# Altium schematic sheet Backplane_Powersupply.SchDoc
size A4
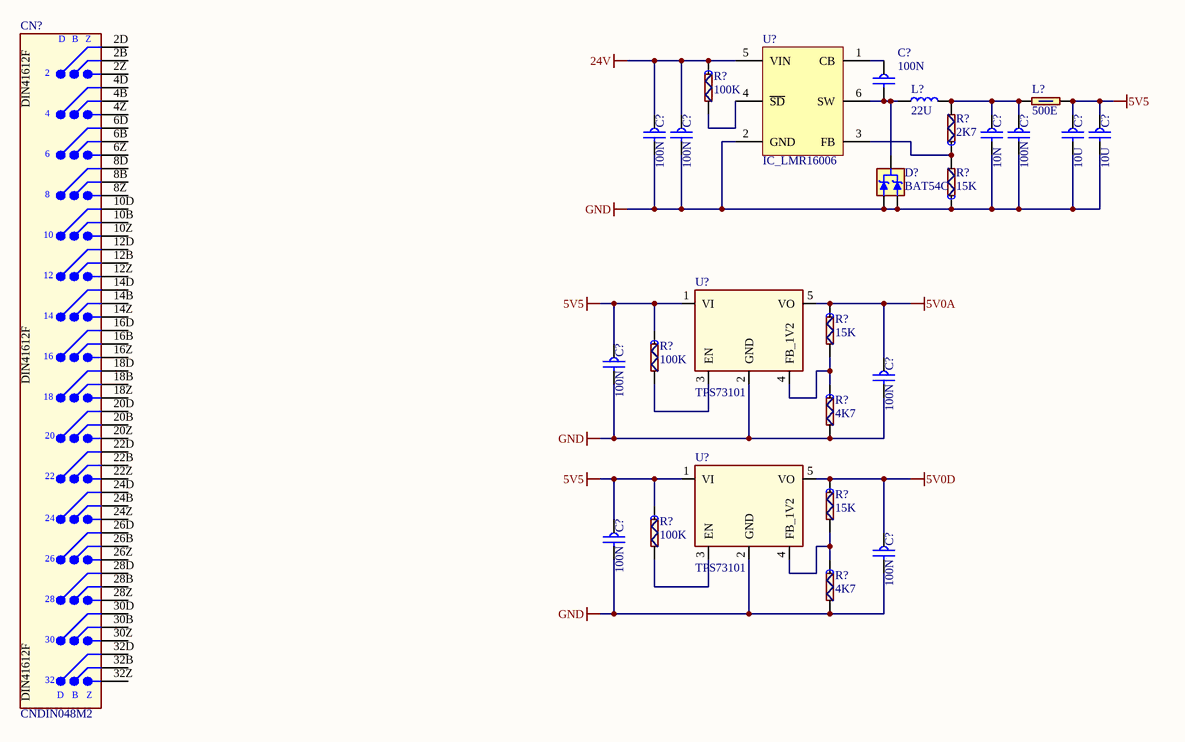
[diagram p0: Backplane_Powersupply.SchDoc]

## Parts
(Parts that share a designator on the sheet are numbered #1, #2 ... from top to bottom, then left to right.)
C?#1  100N  [CA_STD0603_H8]
C?#2  100N  [CA_STD0603_H8]
C?#3  100N  [CA_STD0603_H8]
C?#4  10N  [CA_STD0603_H8]
C?#5  100N  [CA_STD0603_H8]
C?#6  10U  [CA_STD0603_H8]
C?#7  10U  [CA_STD0603_H8]
C?#8  100N  [CA_STD0603_H8]
C?#9  100N  [CA_STD0603_H8]
C?#10  100N  [CA_STD0603_H8]
C?#11  100N  [CA_STD0603_H8]
CN?  CNDIN048M2  [CN_DIN41612F_ZBD_48P_MH]
D?  BAT54C  [SC_SOT23_3P]
L?#1  22U  [CL_STD8040S]
L?#2  500E  [CL_STD1206_H16]
R?#1  100K  [RE_STD0603_H5]
R?#2  2K7  [RE_STD0603_H5]
R?#3  15K  [RE_STD0603_H5]
R?#4  15K  [RE_STD0603_H5]
R?#5  100K  [RE_STD0603_H5]
R?#6  4K7  [RE_STD0603_H5]
R?#7  15K  [RE_STD0603_H5]
R?#8  100K  [RE_STD0603_H5]
R?#9  4K7  [RE_STD0603_H5]
U?#1  IC_LMR16006  [SC_SOT23_6P]
U?#2  TPS73101  [SC_SOT23_5P]
U?#3  TPS73101  [SC_SOT23_5P]

## Nets
5V0A: C?#9.1 R?#4.1 U?#2.5(VO)
5V0D: C?#11.1 R?#7.1 U?#3.5(VO)
5V5: C?#6.1 C?#7.1 C?#8.1 C?#10.1 L?#2.2 R?#5.1 R?#8.1 U?#2.1(VI) U?#3.1(VI)
24V: C?#2.1 C?#3.1 R?#1.1 U?#1.5(VIN)
GND: C?#2.2 C?#3.2 C?#4.2 C?#5.2 C?#6.2 C?#7.2 C?#8.2 C?#9.2 C?#10.2 C?#11.2 D?.1(A1) D?.2(A2) R?#3.1 R?#6.2 R?#9.2 U?#1.2(GND) U?#2.2(GND) U?#3.2(GND)
NetC?#1_1: C?#1.1 U?#1.1(CB)
NetC?#1_2: C?#1.2 D?.3(C) L?#1.1 U?#1.6(SW)
NetC?#4_1: C?#4.1 C?#5.1 L?#1.2 L?#2.1 R?#2.2
NetR?#1_2: R?#1.2 U?#1.4(~{SD})
NetR?#2_1: R?#2.1 R?#3.2 U?#1.3(FB)
NetR?#4_2: R?#4.2 R?#6.1 U?#2.4(FB_1V2)
NetR?#5_2: R?#5.2 U?#2.3(EN)
NetR?#7_2: R?#7.2 R?#9.1 U?#3.4(FB_1V2)
NetR?#8_2: R?#8.2 U?#3.3(EN)

Not connected (* = marked no-connect by the designer): CN? 2B(b2) 2D(d2) 2Z(z2) 4B(b4) 4D(d4) 4Z(z4) 6B(b6) 6D(d6) 6Z(z6) 8B(b8) 8D(d8) 8Z(z8) 10B(b10) 10D(d10) 10Z(z10) 12B(b12) 12D(d12) 12Z(z12) 14B(b14) 14D(d14) 14Z(z14) 16B(b16) 16D(d16) 16Z(z16) 18B(b18) 18D(d18) 18Z(z18) 20B(b20) 20D(d20) 20Z(z20) 22B(b22) 22D(d22) 22Z(z22) 24B(b24) 24D(d24) 24Z(z24) 26B(b26) 26D(d26) 26Z(z26) 28B(b28) 28D(d28) 28Z(z28) 30B(b30) 30D(d30) 30Z(z30) 32B(b32) 32D(d32) 32Z(z32)

## Notes on the sheet
- Title
- Size:
- Date:
- A4
- Number:
- Time:
- Revision:
- Sheet
- of
- File:
- (in symbol CNDIN048M2) D; B; Z; 2; 4; 6; 8; 10; 12; 14; 16; 18; 20; 22; 24; 26; 28; 30; 32

## Library data of the parts
C?#1-C?#3 C?#5 C?#8-C?#11 = YCAM100N-5: STD MLCC 100nF 50V X7R 10% 0603; Property 1: 0603; 3D_model: step; Order Code: murata/GCJ188R71H104KA12D; Article: YCAM100N-5; Catalogus_Nr: YCAM100N-5; Category: Capacitor; SubCategory: Ceramic; Status: P; Value: 100N; Property 2: 50V; Property 3: X7R; Cost: 0,003
C?#4 = YCAM10N-1: STD MLCC 10nF 50V X7R 10% 0603; Property 1: 0603; 3D_model: step; Order Code: avx/06035C103KAT2A; Article: YCAM10N-1; Catalogus_Nr: YCAM10N-1; Category: Capacitor; SubCategory: Ceramic; Status: P; Value: 10N; Property 2: 50V; Property 3: X7R; Cost: 0,002
C?#6 C?#7 = YCAM10U-2: STD MLCC 10uF 10% X5R 6V3 -55°C to +85°C 15% 0603; Property 1: 0603; 3D_model: step; Order Code: kemet/C0603C106M9PACTU; Article: YCAM10U-2; Catalogus_Nr: YCAM10U-2; Category: Capacitor; SubCategory: Ceramic; Status: P; Value: 10U; Property 2: 6V3; Property 3: X5R; Cost: 0,015
CN? = CNDIN048M2: DIN41612/F  Angled Male; Value: PLUG; Property 1: 48p; Property 2: 90D; 3D_model: step; Article: CNDIN048M2; Catalogus_Nr: CNDIN048M2; Category: Connector; SubCategory: DIN41612F; Status: A; Cost: 1,500
D? = YDIOBAT54-1: Schottky 30V/0.2A; Property 1: 30V; Property 2: 200MA; 3D_model: step; Article: YDIOBAT54-1; Catalogus_Nr: YDIOBAT54-1; Category: Diode; SubCategory: Schottky; Status: A; Value: BAT54C; Cost: 0,010
L?#1 = YCOL22U-8: STD Inductor Power 22uH 30%  2200mA 75mOhm; Property 2: 8X8X5; 3D_model: step; Article: YCOL22U-8; Catalogus_Nr: YCOL22U-8; Category: Inductor; SubCategory: Power; Status: P; Value: 22U; Property 1: 2200mA; Property 3: 75mOhm; Cost: 0,300
L?#2 = YFIL31: EMI/RFI Suppressor-Ferrit-500E; Article: YFIL31; Property 1: 2000MA; Property 2: 1206; Property 3: 60mOhm; 3D_model: step; Order Code: laird-signal-integrity/MI1206L501R-10; Catalogus_Nr: YFIL31; Category: Inductor; SubCategory: Bead; Status: P; Value: 500E; Cost: 0,040
R?#1 R?#5 R?#8 = YRES100K-1: Chip-100K/100mW/1%/100ppm/100V/-40°C/+125°C; Property 1: 0603; Property 2: 1%; Property 3: 100mW; 3D_model: step; Order Code: RC0603FR-07100KL; Article: YRES100K-1; Catalogus_Nr: YRES100K-1; Category: Resistor; SubCategory: STD0603; Status: P; Value: 100K; Cost: 0,0005
R?#2 = YRES2K7-1: Chip-2K7/100mW/1%/100ppm/100V/-40°C/+125°C; Property 1: 0603; Property 2: 1%; Property 3: 100mW; 3D_model: step; Article: YRES2K7-1; Catalogus_Nr: YRES2K7-1; Category: Resistor; SubCategory: STD0603; Status: P; Value: 2K7; Cost: 0,0005
R?#3 R?#4 R?#7 = YRES15K-1: Chip-15K/100mW/1%/100ppm/100V/-40°C/+125°C; Property 1: 0603; Property 2: 1%; Property 3: 100mW; 3D_model: step; Order Code: yageo/RC0603FR-0715KL; Article: YRES15K-1; Catalogus_Nr: YRES15K-1; Category: Resistor; SubCategory: STD0603; Status: P; Value: 15K; Cost: 0,0005
R?#6 R?#9 = YRES4K7-1: Chip-4K7/100mW/1%/100ppm/100V/-40°C/+125°C; Property 1: 0603; Property 2: 1%; Property 3: 100mW; 3D_model: step; Order Code: yageo/RC0603FR-074K7L; Article: YRES4K7-1; Catalogus_Nr: YRES4K7-1; Category: Resistor; SubCategory: STD0603; Status: P; Value: 4K7; Cost: 0,0005
U?#1 = IC_LMR16006: 60 V 0.6 A Buck Regulators With High Efficiency; Order Code: 296-40293-1-ND; Article: IC_LMR16006; Category: IC; SubCategory: SMPS; Status: A; Value: IC_LMR16006
U?#2 U?#3 = YICRTPS73101: LDO Ui1V7-5V5 Uo=1V2-5V5-150mA; 3D_model: step; Order Code: texas-instruments/TPS73101DBVR; Article: YICRTPS73101; Catalogus_Nr: YICRTPS73101; Category: IC; SubCategory: Regulator; Status: P; Value: TPS73101; Property 1: LDO; Cost: 0,300